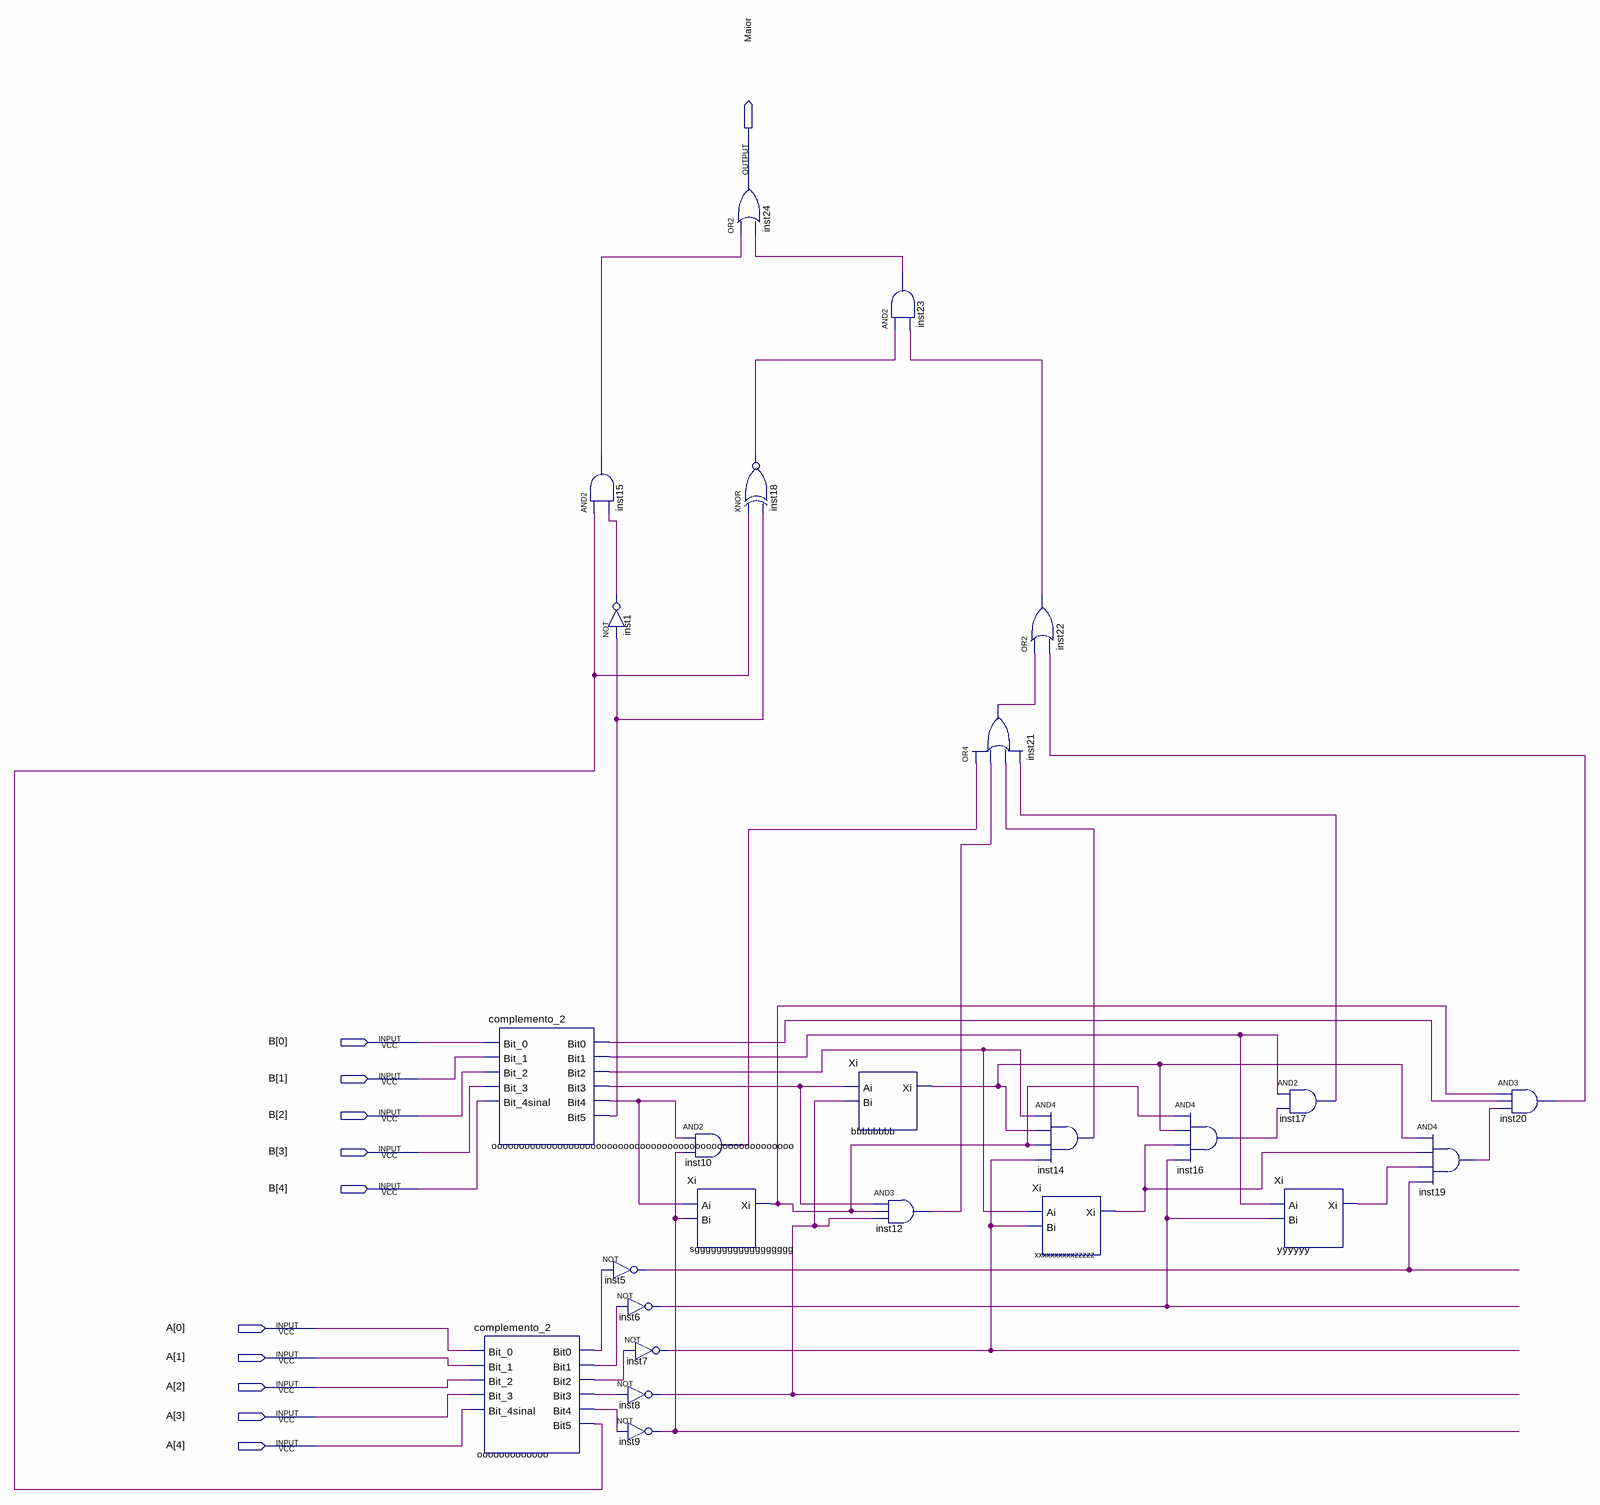
[diagram p0: schematic sheet]
// Quartus schematic comparador_menorsimbol.bdf as structural Verilog: 25 symbols, 11 pins
module comparador_menorsimbol (
  input  [4:0] B,
  input  [4:0] A,
  output Maior
);

  wire bbbbbbbb_xi, inst1_out, inst5_out, inst6_out, inst7_out, inst8_out, inst9_out, inst10_out, inst12_out,
       inst14_out, inst15_out, inst16_out, inst17_out, inst18_out, inst19_out, inst20_out, inst21_out,
       inst22_out, inst23_out, ooooooooooooo_bit0, ooooooooooooo_bit1, ooooooooooooo_bit2,
       ooooooooooooo_bit3, ooooooooooooo_bit4, ooooooooooooo_bit5,
       ooooooooooooooooooooooooooooooooooooooooooooooooooooooo_bit0,
       ooooooooooooooooooooooooooooooooooooooooooooooooooooooo_bit1,
       ooooooooooooooooooooooooooooooooooooooooooooooooooooooo_bit2,
       ooooooooooooooooooooooooooooooooooooooooooooooooooooooo_bit3,
       ooooooooooooooooooooooooooooooooooooooooooooooooooooooo_bit4,
       ooooooooooooooooooooooooooooooooooooooooooooooooooooooo_bit5, sgggggggggggggggggg_xi,
       xxxxxxxxxxzzzzz_xi, yyyyyy_xi;

  complemento_2 ooooooooooooooooooooooooooooooooooooooooooooooooooooooo (
    .Bit_0(B[0]), .Bit_1(B[1]), .Bit_2(B[2]), .Bit_3(B[3]), .Bit_4sinal(B[4]),
    .Bit0(ooooooooooooooooooooooooooooooooooooooooooooooooooooooo_bit0),
    .Bit1(ooooooooooooooooooooooooooooooooooooooooooooooooooooooo_bit1),
    .Bit2(ooooooooooooooooooooooooooooooooooooooooooooooooooooooo_bit2),
    .Bit3(ooooooooooooooooooooooooooooooooooooooooooooooooooooooo_bit3),
    .Bit4(ooooooooooooooooooooooooooooooooooooooooooooooooooooooo_bit4),
    .Bit5(ooooooooooooooooooooooooooooooooooooooooooooooooooooooo_bit5));
  complemento_2 ooooooooooooo (
    .Bit_0(A[0]), .Bit_1(A[1]), .Bit_2(A[2]), .Bit_3(A[3]), .Bit_4sinal(A[4]), .Bit0(ooooooooooooo_bit0),
    .Bit1(ooooooooooooo_bit1), .Bit2(ooooooooooooo_bit2), .Bit3(ooooooooooooo_bit3),
    .Bit4(ooooooooooooo_bit4), .Bit5(ooooooooooooo_bit5));
  and inst15 (inst15_out, ooooooooooooo_bit5, inst1_out);
  not inst1 (inst1_out, ooooooooooooooooooooooooooooooooooooooooooooooooooooooo_bit5);
  not inst5 (inst5_out, ooooooooooooo_bit0);
  not inst6 (inst6_out, ooooooooooooo_bit1);
  not inst7 (inst7_out, ooooooooooooo_bit2);
  not inst8 (inst8_out, ooooooooooooo_bit3);
  not inst9 (inst9_out, ooooooooooooo_bit4);
  or inst24 (Maior, inst15_out, inst23_out);
  and inst10 (inst10_out, ooooooooooooooooooooooooooooooooooooooooooooooooooooooo_bit4, inst9_out);
  Xi sgggggggggggggggggg (
    .Ai(ooooooooooooooooooooooooooooooooooooooooooooooooooooooo_bit4), .Bi(inst9_out),
    .Xi(sgggggggggggggggggg_xi));
  xnor inst18 (inst18_out, ooooooooooooo_bit5, ooooooooooooooooooooooooooooooooooooooooooooooooooooooo_bit5);
  Xi bbbbbbbb (.Ai(ooooooooooooooooooooooooooooooooooooooooooooooooooooooo_bit3), .Bi(inst8_out), .Xi(bbbbbbbb_xi));
  and inst23 (inst23_out, inst18_out, inst22_out);
  and inst12 (inst12_out, ooooooooooooooooooooooooooooooooooooooooooooooooooooooo_bit3, sgggggggggggggggggg_xi, inst8_out);
  or inst21 (inst21_out, inst10_out, inst12_out, inst14_out, inst17_out);
  or inst22 (inst22_out, inst21_out, inst20_out);
  and inst14 (inst14_out, ooooooooooooooooooooooooooooooooooooooooooooooooooooooo_bit2, bbbbbbbb_xi, sgggggggggggggggggg_xi, inst7_out);
  Xi xxxxxxxxxxzzzzz (
    .Ai(ooooooooooooooooooooooooooooooooooooooooooooooooooooooo_bit2), .Bi(inst7_out), .Xi(xxxxxxxxxxzzzzz_xi));
  and inst16 (inst16_out, sgggggggggggggggggg_xi, bbbbbbbb_xi, xxxxxxxxxxzzzzz_xi, inst6_out);
  and inst17 (inst17_out, ooooooooooooooooooooooooooooooooooooooooooooooooooooooo_bit1, inst16_out);
  Xi yyyyyy (.Ai(ooooooooooooooooooooooooooooooooooooooooooooooooooooooo_bit1), .Bi(inst6_out), .Xi(yyyyyy_xi));
  and inst19 (inst19_out, bbbbbbbb_xi, xxxxxxxxxxzzzzz_xi, yyyyyy_xi, inst5_out);
  and inst20 (inst20_out, sgggggggggggggggggg_xi, ooooooooooooooooooooooooooooooooooooooooooooooooooooooo_bit0, inst19_out);
endmodule
